# EAGLE design Focuser-proto (EAGLE 7.0.0)
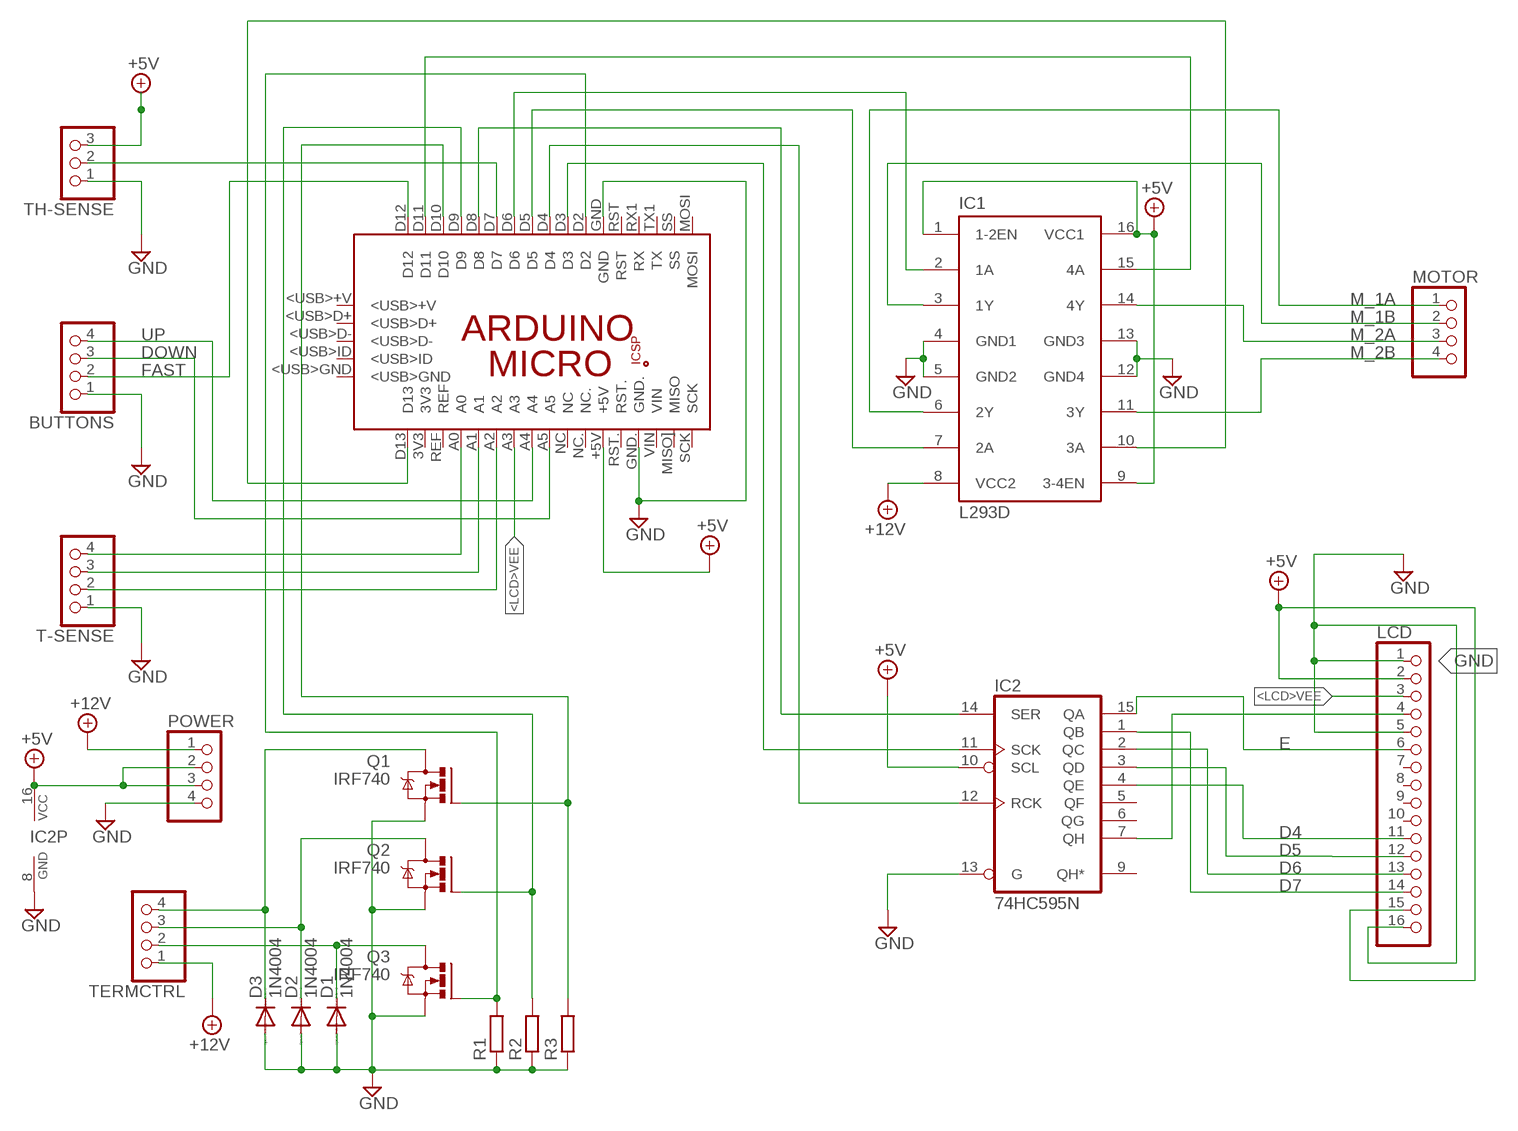
[diagram p0: schematic, sheet 1]

## Parts
BUTTONS  PINHD-1X4  [1X04]
D1  1N4004  [DO41-10]
D2  1N4004  [DO41-10]
D3  1N4004  [DO41-10]
IC1  L293D  [DIL16]
IC2  74HC595N  [DIL16]
LCD  PINHD-1X16  [1X16]
MOTOR  PINHD-1X4  [1X04]
PCB1  ARDUINO_MICRO  [ARDUINO_MICRO]
POWER  PINHD-1X4  [1X04]
Q1  IRF740  [TO220BV]
Q2  IRF740  [TO220BV]
Q3  IRF740  [TO220BV]
R1  R-EU_0207/7  [0207/7]
R2  R-EU_0207/7  [0207/7]
R3  R-EU_0207/7  [0207/7]
T-SENSE  PINHD-1X4  [1X04]
TERMCTRL  PINHD-1X4  [1X04]
TH-SENSE  PINHD-1X3  [1X03]

## Nets
+5V [Power]: IC1.1(1-2EN) IC1.9(3-4EN) IC1.16(VCC1) IC2.10(SCL) IC2.16(VCC) LCD.2 LCD.15 PCB1.+5V POWER.2 POWER.3 TH-SENSE.3
+12V [Power]: IC1.8(VCC2) POWER.1 TERMCTRL.1
<LCD>VEE: LCD.3 PCB1.A3
D4: IC2.4(QE) LCD.11
D5: IC2.3(QD) LCD.12
D6: IC2.2(QC) LCD.13
D7: IC2.1(QB) LCD.14
DOWN: BUTTONS.3 PCB1.A5
E: IC2.15(QA) LCD.6
FAST: BUTTONS.2 PCB1.D12
GND [Power]: BUTTONS.1 D1.A D2.A D3.A IC1.4(GND1) IC1.5(GND2) IC1.12(GND4) IC1.13(GND3) IC2.8(GND) IC2.13(G) LCD.1 LCD.5 LCD.16 PCB1.GND PCB1.GND. POWER.4 Q1.S Q2.S Q3.S R1.1 R2.1 R3.1 T-SENSE.1 TH-SENSE.1
M_1A: IC1.6(2Y) MOTOR.1
M_1B: IC1.3(1Y) MOTOR.2
M_2A: IC1.14(4Y) MOTOR.3
M_2B: IC1.11(3Y) MOTOR.4
N$1: PCB1.A2 T-SENSE.2
N$2: PCB1.A0 T-SENSE.4
N$3: PCB1.A1 T-SENSE.3
N$4 [Power]: D1.C Q3.D TERMCTRL.2
N$5 [Power]: D2.C Q2.D TERMCTRL.3
N$6 [Power]: D3.C Q1.D TERMCTRL.4
N$7: PCB1.D2 Q3.G R1.2
N$8: IC2.11(SCK) PCB1.D3
N$9: IC1.2(1A) PCB1.D6
N$10: IC1.7(2A) PCB1.D5
N$11: IC1.15(4A) PCB1.D11
N$13: IC1.10(3A) PCB1.D13
N$14: PCB1.D7 TH-SENSE.2
N$17: IC2.12(RCK) PCB1.D4
N$18: IC2.14(SER) PCB1.D8
N$19: IC2.7(QH) LCD.4
N$21: PCB1.D9 Q2.G R2.2
N$22: PCB1.D10 Q1.G R3.2
UP: BUTTONS.4 PCB1.A4
Unconnected: IC2.5(QF) IC2.6(QG) IC2.9(QH*) LCD.7 LCD.8 LCD.9 LCD.10 PCB1.3V3 PCB1.5V PCB1.<USB>+V PCB1.<USB>D+ PCB1.<USB>D- PCB1.<USB>GND PCB1.<USB>ID PCB1.GND_ PCB1.MISO. PCB1.MISO](MISO) PCB1.MOSI PCB1.MOSI. PCB1.NC PCB1.NC. PCB1.REF PCB1.RESET.. PCB1.RST PCB1.RST. PCB1.RX1(RX) PCB1.SCK PCB1.SCK. PCB1.SS PCB1.TX1(TX) PCB1.VIN

## Library data of the parts
BUTTONS MOTOR POWER T-SENSE TERMCTRL = pinhead:PINHD-1X4: PIN HEADER
D1-D3 = diode:1N4004: DIODE general purpose rectifier, 1 A
IC1 = st-microelectronics:L293D: PUSH-PULL 4 CHANNEL DRIVER; MPN: L293D; OC_FARNELL: 9589619; OC_NEWARK: 56P8249
IC2 = 74xx-eu:74*595: 8-bit SHIFT REGISTER, output latch
LCD = pinhead:PINHD-1X16: PIN HEADER
PCB1 = E14_Arduino:ARDUINO_MICRO: Device for representing an Arduino Micro board with a footprint in an EAGLE design. Created by Dave Young for Element14. More EAGLE documentation at: http://www.element14.com/community/community/knode/cadsoft_eagle
Q1-Q3 = transistor-power:IRF740: N-CHANNEL MOS FET
R1-R3 = resistor:R-EU_: RESISTOR, European symbol
TH-SENSE = pinhead:PINHD-1X3: PIN HEADER

## Net classes
1 Power: width 0.813 mm, clearance 0.406 mm

## Board
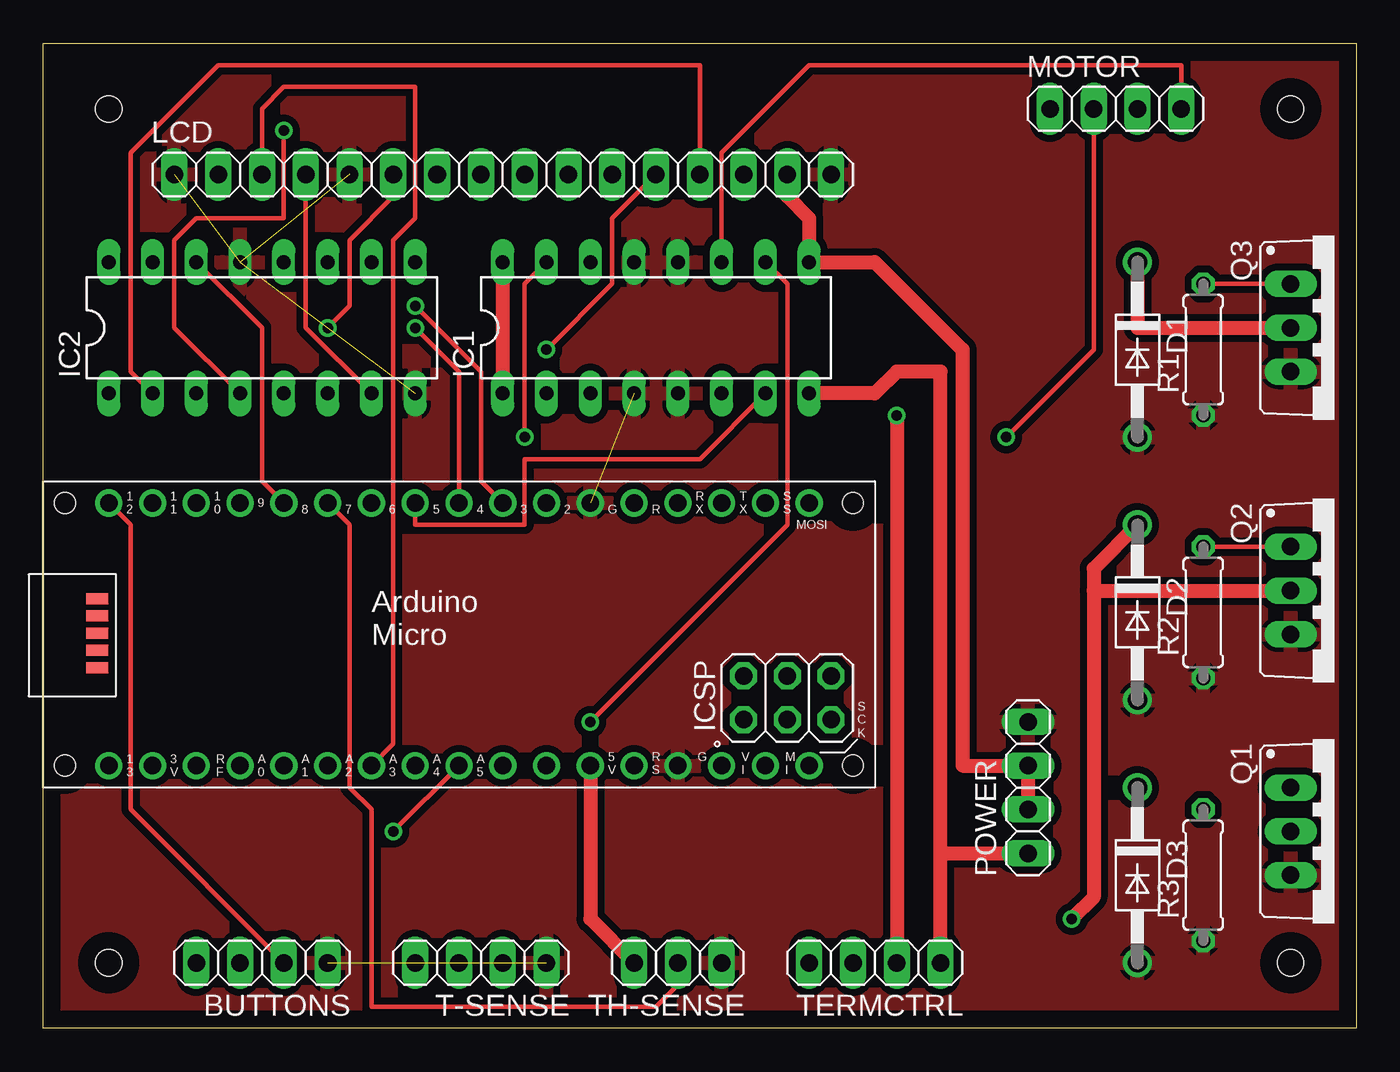
[diagram p1: board, top side]
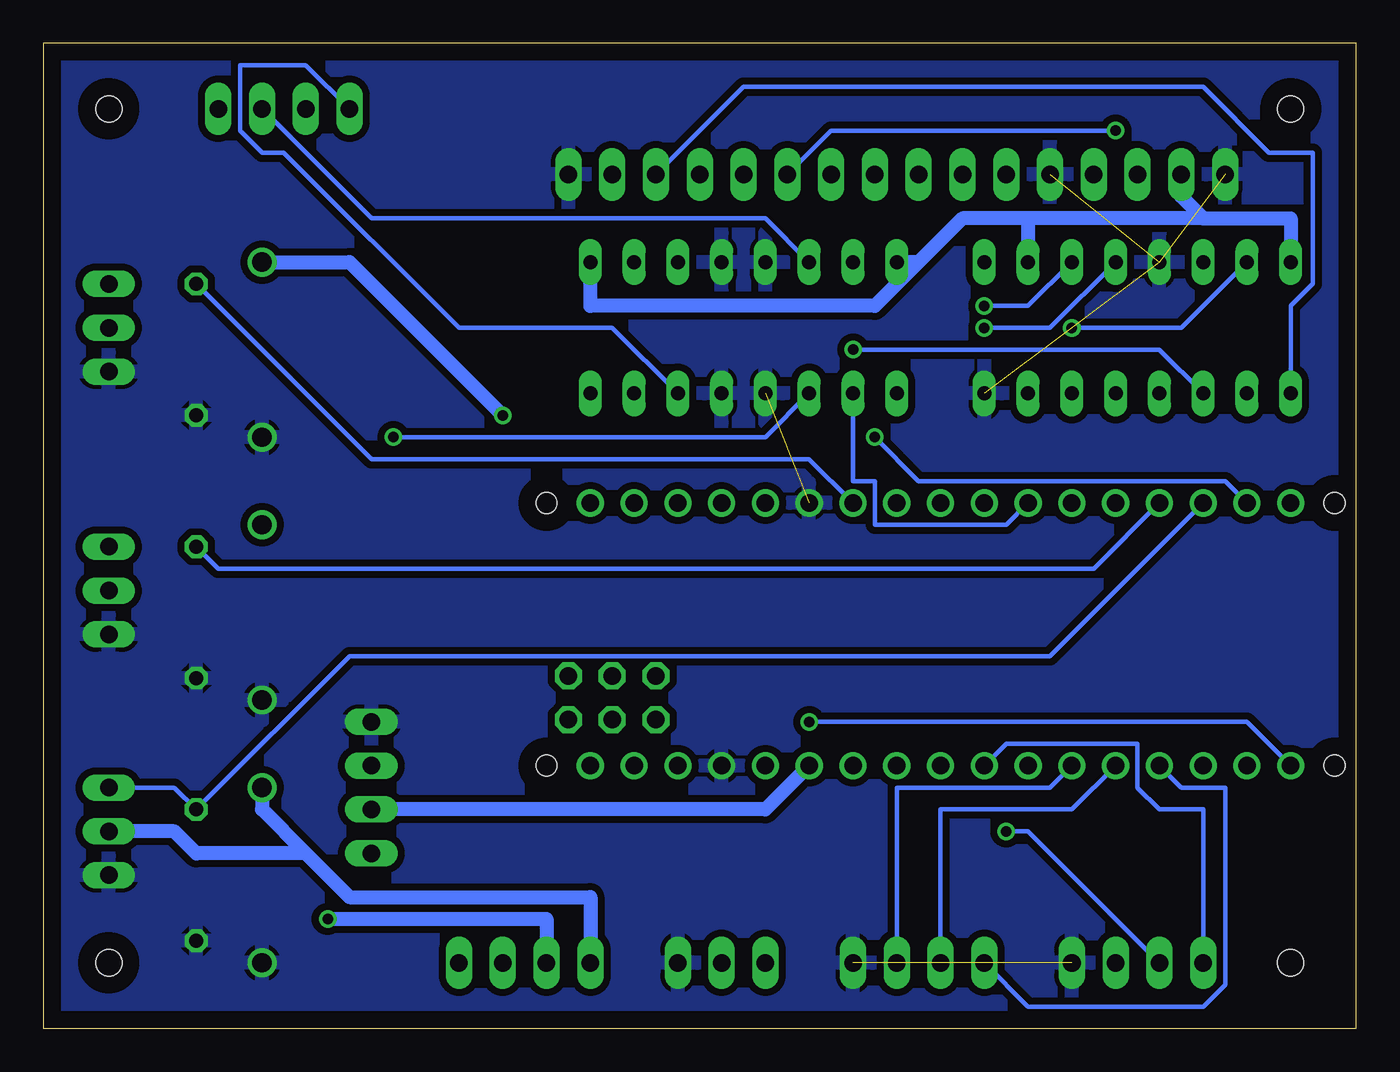
[diagram p2: board, bottom side, seen from below]

Size 76.2 x 57.15 mm. Coordinates in mm from the lower left corner, seen from the top.
Outline: 0,57.15 76.2,57.15 76.2,0 0,0 0,57.15
Copper layers (1*16): Top 0.035mm / dielectric 1.5mm / Bottom 0.035mm
Design rules "default": minimum track width 10mil, minimum drill 24mil, track to track 8mil, track to pad 8mil, pad to pad 8mil, via to via 8mil, smd to smd 8mil, copper to edge 40mil, drill to drill 8mil, minimum pad ring 10mil, minimum via ring 8mil, stop-mask expansion 4mil, vias tented up to drill 0mil, thermal gap 10mil
Holes 1.5 mm at 3.81,53.34 72.39,53.34 72.39,3.81 3.81,3.81

### Footprints (pad centres in the part's own frame; a part is rotated, then mirrored left to right if it is on the bottom)
1X04 = drill 1.016 long: 1 -3.81,0; 2 -1.27,0; 3 1.27,0; 4 3.81,0
DO41-10 = drill 1.118: A 5.08,0; C -5.08,0
DIL16 = drill 0.813 long: 1 -8.89,-3.81; 2 -6.35,-3.81; 3 -3.81,-3.81; 4 -1.27,-3.81; 5 1.27,-3.81; 6 3.81,-3.81; 7 6.35,-3.81; 8 8.89,-3.81; 9 8.89,3.81; 10 6.35,3.81; 11 3.81,3.81; 12 1.27,3.81; 13 -1.27,3.81; 14 -3.81,3.81; 15 -6.35,3.81; 16 -8.89,3.81
1X16 = drill 1.016 long: 1 -19.05,0; 2 -16.51,0; 3 -13.97,0; 4 -11.43,0; 5 -8.89,0; 6 -6.35,0; 7 -3.81,0; 8 -1.27,0; 9 1.27,0; 10 3.81,0; 11 6.35,0; 12 8.89,0; 13 11.43,0; 14 13.97,0; 15 16.51,0; 16 19.05,0
ARDUINO_MICRO = drill 1.016 pad 1.575: 3V3 6.35,1.27; +5V 31.75,1.27; A0 11.43,1.27; A1 13.97,1.27; A2 16.51,1.27; A3 19.05,1.27; A4 21.59,1.27; A5 24.13,1.27; D2 29.21,16.51; D3 26.67,16.51; D4 24.13,16.51; D5 21.59,16.51; D6 19.05,16.51; D7 16.51,16.51; D8 13.97,16.51; D9 11.43,16.51; D10 8.89,16.51; D11 6.35,16.51; D12 3.81,16.51; D13 3.81,1.27; GND 31.75,16.51; GND. 36.83,1.27; MISO] 41.91,1.27; MOSI 44.45,16.51; NC 26.67,1.27; NC. 29.21,1.27; REF 8.89,1.27; RST 34.29,16.51; RST. 34.29,1.27; RX1 36.83,16.51; SCK 44.45,1.27; SS 41.91,16.51; TX1 39.37,16.51; VIN 39.37,1.27 | drill 1.016 pad 1.575 octagon: 5V 40.64,6.477; GND_ 45.72,6.477; MISO. 40.64,3.937; MOSI. 43.18,6.477; RESET.. 45.72,3.937; SCK. 43.18,3.937 | smd 1.27 x 0.635: <USB>+V 3.15,10.947; <USB>D+ 3.15,9.957; <USB>D- 3.15,8.941; <USB>GND 3.15,6.96; <USB>ID 3.15,7.976 | hole 1.2: 1.27,1.27; 1.27,16.51; 46.99,16.51; 46.99,1.27
TO220BV = drill 1.016 long: D 0,-2.54; G -2.54,-2.54; S 2.54,-2.54
0207/7 = drill 0.813 octagon: 1 -3.81,0; 2 3.81,0
1X03 = drill 1.016 long: 1 -2.54,0; 2 0,0; 3 2.54,0

### Placement (x,y rotation side)
BUTTONS  12.7,3.81 180 top
D1  63.5,39.37 270 top
D2  63.5,24.13 270 top
D3  63.5,8.89 270 top
IC1  35.56,40.64 0 top
IC2  12.7,40.64 0 top
LCD  26.67,49.53 0 top
MOTOR  62.23,53.34 0 top
PCB1  0,13.97 0 top
POWER  57.15,13.97 90 top
Q1  74.93,11.43 270 top
Q2  74.93,25.4 270 top
Q3  74.93,40.64 270 top
R1  67.31,39.37 90 top
R2  67.31,24.13 90 top
R3  67.31,8.89 90 top
T-SENSE  25.4,3.81 180 top
TERMCTRL  48.26,3.81 180 top
TH-SENSE  36.83,3.81 180 top

### Tracks (layer width: path | path; a pad name or v marks a point on that pad's centre or on a via)
+5V
  Top 0.813: POWER.2 POWER.3 53.34,15.24 53.34,39.37 48.26,44.45 IC1.9 44.45,46.99 43.18,48.26 LCD.15 | TH-SENSE.3 31.75,6.35 PCB1.+5V | IC1.16 IC1.1
  Bottom 0.813: POWER.2 34.29,12.7 PCB1.+5V | IC2.16 3.81,46.99 8.89,46.99 | 8.89,46.99 10.16,48.26 LCD.2 | 19.05,46.99 IC2.10 | 8.89,46.99 19.05,46.99 | IC1.9 44.45,41.91 27.94,41.91 25.4,44.45 | 25.4,44.45 22.86,46.99 19.05,46.99 | 25.4,44.45 IC1.16
+12V
  Top 0.813: IC1.8 48.26,36.83 49.53,38.1 52.07,38.1 52.07,10.16 | TERMCTRL.1 52.07,10.16 | 52.07,10.16 POWER.1
<LCD>VEE
  Top 0.254: LCD.3 12.7,53.34 13.97,54.61 21.59,54.61 21.59,46.99 20.32,45.72 20.32,16.51 PCB1.A3
D4  (via drill 0.61)
  Top 0.254: IC2.4 7.62,40.64 7.62,45.72 8.89,46.99 13.97,46.99 v13.97,52.07
  Bottom 0.254: v13.97,52.07 30.48,52.07 LCD.11
D5  (via drill 0.61)
  Top 0.254: v29.21,39.37 33.02,43.18 33.02,46.99 LCD.12
  Bottom 0.254: IC2.3 11.43,39.37 v29.21,39.37
D6
  Top 0.254: IC2.2 5.08,38.1 5.08,50.8 10.16,55.88 38.1,55.88 LCD.13
D7
  Bottom 0.254: IC2.1 3.81,41.91 2.54,43.18 2.54,50.8 5.08,50.8 8.89,54.61 35.56,54.61 LCD.14
DOWN  (via drill 0.61)
  Top 0.254: PCB1.A5 v20.32,11.43
  Bottom 0.254: BUTTONS.3 19.05,11.43 v20.32,11.43
E  (via drill 0.61)
  Top 0.254: v16.51,40.64 17.78,41.91 17.78,45.72 20.32,48.26 LCD.6
  Bottom 0.254: IC2.15 10.16,40.64 v16.51,40.64
FAST
  Top 0.254: BUTTONS.2 5.08,12.7 5.08,29.21 PCB1.D12
GND  (5 unrouted)
  pour Bottom: -1.27,-1.27 77.47,-1.27 77.47,58.42 -1.27,58.42
  pour Top: -1.27,-1.27 77.47,-1.27 77.47,58.42 -1.27,58.42
M_1A
  Bottom 0.254: IC1.6 43.18,40.64 52.07,40.64 62.23,50.8 63.5,50.8 64.77,52.07 64.77,55.88 60.96,55.88 MOTOR.1
M_1B  (via drill 0.61)
  Top 0.254: v55.88,34.29 60.96,39.37 MOTOR.2
  Bottom 0.254: IC1.3 34.29,34.29 v55.88,34.29
M_2A
  Bottom 0.254: IC1.14 34.29,46.99 57.15,46.99 MOTOR.3
M_2B
  Top 0.254: IC1.11 39.37,50.8 44.45,55.88 66.04,55.88 MOTOR.4
N$1
  Bottom 0.254: T-SENSE.2 26.67,13.97 17.78,13.97 PCB1.A2
N$2
  Bottom 0.254: T-SENSE.4 19.05,1.27 8.89,1.27 7.62,2.54 7.62,13.97 10.16,13.97 PCB1.A0
N$3
  Bottom 0.254: T-SENSE.3 24.13,12.7 16.51,12.7 PCB1.A1
N$4  (via drill 0.61)
  Top 0.813: v49.53,35.56 TERMCTRL.2 | Q3.D 63.5,40.64 D1.C
  Bottom 0.813: v49.53,35.56 58.42,44.45 D1.C
N$5  (via drill 0.61)
  Top 0.813: v59.69,6.35 60.96,7.62 60.96,25.4 | 60.96,25.4 60.96,26.67 D2.C | 60.96,25.4 Q2.D
  Bottom 0.813: TERMCTRL.3 46.99,6.35 v59.69,6.35
N$6
  Bottom 0.813: TERMCTRL.4 44.45,7.62 58.42,7.62 60.96,10.16 | 60.96,10.16 63.5,12.7 D3.C | Q1.D 68.58,11.43 67.31,10.16 60.96,10.16
N$7
  Top 0.254: Q3.G R1.2
  Bottom 0.254: PCB1.D2 31.75,33.02 57.15,33.02 R1.2
N$8  (via drill 0.61)
  Top 0.254: v21.59,41.91 25.4,38.1 25.4,31.75 PCB1.D3
  Bottom 0.254: IC2.11 19.05,41.91 v21.59,41.91
N$9
  Bottom 0.254: IC1.2 29.21,31.75 27.94,31.75 27.94,29.21 20.32,29.21 PCB1.D6
N$10
  Top 0.254: IC1.7 38.1,33.02 27.94,33.02 27.94,29.21 21.59,29.21 PCB1.D5
N$11  (via drill 0.61)
  Top 0.254: IC1.15 27.94,43.18 v27.94,34.29
  Bottom 0.254: v27.94,34.29 25.4,31.75 7.62,31.75 PCB1.D11
N$13  (via drill 0.61)
  Top 0.254: IC1.10 43.18,43.18 43.18,29.21 v31.75,17.78
  Bottom 0.254: v31.75,17.78 6.35,17.78 PCB1.D13
N$14
  Top 0.254: TH-SENSE.2 36.83,2.54 35.56,1.27 19.05,1.27 19.05,12.7 17.78,13.97 17.78,29.21 PCB1.D7
N$17  (via drill 0.61)
  Top 0.254: v21.59,40.64 24.13,38.1 PCB1.D4
  Bottom 0.254: IC2.12 17.78,40.64 v21.59,40.64
N$18
  Top 0.254: IC2.14 12.7,40.64 12.7,31.75 PCB1.D8
N$19
  Top 0.254: IC2.7 15.24,40.64 LCD.4
N$21
  Top 0.254: Q2.G R2.2
  Bottom 0.254: PCB1.D9 15.24,26.67 66.04,26.67 R2.2
N$22
  Bottom 0.254: Q1.G 68.58,13.97 R3.2 58.42,21.59 17.78,21.59 PCB1.D10
UP
  Bottom 0.254: BUTTONS.4 8.89,12.7 11.43,12.7 12.7,13.97 12.7,16.51 20.32,16.51 PCB1.A4